# EAGLE design SCHv2 (EAGLE 9.1.3)
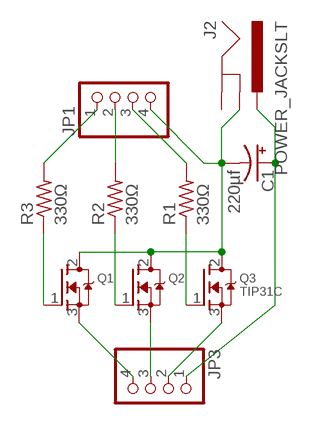
[diagram p0: schematic, sheet 1]

## Parts
C1  220µf  CPOL-USE2.5-7  [E2,5-7]
J2  POWER_JACKSLT  [POWER_JACK_SLOT]
JP1  PINHD-1X4/90  [1X04/90]
JP3  PINHD-1X4/90  [1X04/90]
Q1  MOSFET-NGDS_TO220V  [TO220V]
Q2  MOSFET-NGDS_TO220V  [TO220V]
Q3  TIP31C  MOSFET-NGDS_TO220V  [TO220V]
R1  330Ω  R-US_0207/7  [0207/7]
R2  330Ω  R-US_0207/7  [0207/7]
R3  330Ω  R-US_0207/7  [0207/7]

## Nets
N$1: JP1.1 R3.2
N$2: JP1.2 R2.2
N$3: JP1.3 R1.2
N$4: C1.- J2.GND@1(GNDBREAK) JP1.4 Q1.2(D) Q2.2(D) Q3.2(D)
N$5: C1.+ J2.PWR JP3.1
N$6: Q1.1(G) R3.1
N$7: Q2.1(G) R2.1
N$8: Q3.1(G) R1.1
N$9: JP3.2 Q3.3(S)
N$10: JP3.3 Q2.3(S)
N$11: JP3.4 Q1.3(S)
Unconnected: J2.GND@2(GND)

## Library data of the parts
C1 = rcl:CPOL-US: POLARIZED CAPACITOR, American symbol; SPICEPREFIX: C
J2 = SparkFun-Connectors:POWER_JACK: Power Jack Connector This is the standard 5.5mm barrel jack for power. The PTH is the most common, proven, reliable, footprint. The Slot footprint only works if the mill layer is transmitted to the PCB fab house so be warned. Here are the connectors we sell at SparkFun: DC Barrel Power Jack/Connector <https://www.sparkfun.com/products/119> (PRT-00119) DC Barrel Power Jack/Connector (SMD) <https://www.sparkfun.com/products/12748> (PRT-12748) DC Barrel Jack Adapter - Breadboard Compatible <https://www.sparkfun.com/products/10811> (PRT-10811) It is used on this SparkFun product (and many, many others): SparkFun RedBoard - Programmed with Arduino <https://www.sparkfun.com/products/12757> (DEV-12757) Also, if you need a mating power supply or connector, please check these out: Wall Adapter Power Supply - 9VDC 650mA <https://www.sparkfun.com/products/298> (TOL-00298) DC Barrel Jack Adapter - Male <https://www.sparkfun.com/products/10287> (PRT-10287); PROD_ID: PRT-00119
JP1 JP3 = pinhead:PINHD-1X4: PIN HEADER
Q1-Q3 = adafruit:MOSFET-N: N-Channel Mosfet 2N7002E - 60V 260mA SOT23 [Digikey: 2N7002ET1GOSTR-ND] - REEL BSH103 - 30V 850mA SOT23 [Digikey: 568-5013-1-ND]
R1-R3 = rcl:R-US_: RESISTOR, American symbol; SPICEPREFIX: R

## Board
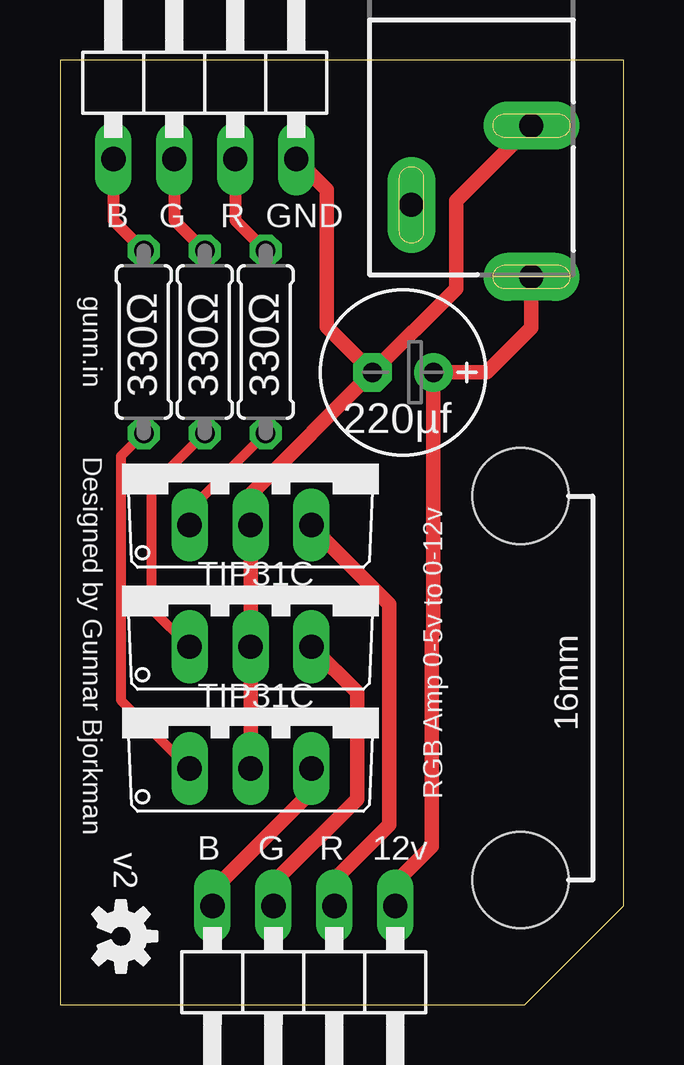
[diagram p1: board, top side]

Size 23.49 x 39.37 mm. Coordinates in mm from the lower left corner, seen from the top.
Outline: 23.49,39.37 0,39.37 0,0 18.1,0 19.37,0 23.49,4.13 23.49,39.37
Copper layers (1*16): Top 0.035mm / dielectric 1.5mm / Bottom 0.035mm
Design rules "default": minimum track width 6mil, minimum drill 0.35mm, track to track 6mil, track to pad 6mil, pad to pad 6mil, via to via 6mil, smd to smd 6mil, copper to edge 40mil, drill to drill 6mil, minimum pad ring 10mil, minimum via ring 8mil, stop-mask expansion 4mil, vias tented up to drill 0mil, thermal gap 10mil
Holes 4 mm at 19.19,21.2 19.19,5.2

### Footprints (pad centres in the part's own frame; a part is rotated, then mirrored left to right if it is on the bottom)
E2,5-7 = drill 0.813 pad 1.6: + -1.27,0 | drill 0.813 pad 1.6 octagon: - 1.27,0
POWER_JACK_SLOT = drill 1 pad 2 long: GND@1 2.58,7.5; GND@2 7.58,10.8; PWR 2.58,13.8
1X04/90 = drill 1.016 long: 1 -3.81,-3.81; 2 -1.27,-3.81; 3 1.27,-3.81; 4 3.81,-3.81
TO220V = drill 1.016 long: 1 -2.54,-2.54; 2 0,-2.54; 3 2.54,-2.54
0207/7 = drill 0.813 octagon: 1 -3.81,0; 2 3.81,0

### Placement (x,y rotation side)
C1  14.29,26.35 180 top
J2  22.23,44.13 180 top
JP1  6.03,39.05 0 top
JP3  10.16,0.32 180 top
Q1  7.94,12.38 0 top
Q2  7.94,17.46 0 top
Q3  7.94,22.54 0 top
R1  8.57,27.62 90 top
R2  6.03,27.62 90 top
R3  3.49,27.62 90 top
U$2  [OSHW-LOGO-S]  2.54,2.86 270 top

### Tracks (layer width: path | path; a pad name or v marks a point on that pad's centre or on a via)
N$1
  Top 0.508: JP1.1 2.22,32.7 R3.2
N$2
  Top 0.508: JP1.2 4.76,32.7 R2.2
N$3
  Top 0.508: JP1.3 7.3,32.7 R1.2
N$4
  Top 0.61: Q1.2 Q2.2 Q3.2 7.94,21.27 C1.- | 11.11,33.34 11.11,33.97 JP1.4 | 11.11,33.34 11.11,33.02 11.11,28.26 C1.- | 11.12,33.33 11.11,33.34 | C1.- 16.51,29.84 16.51,33.5 J2.GND@1
N$5
  Top 0.61: J2.PWR 19.65,28.22 17.78,26.35 C1.+ 15.56,15.52 15.49,15.46 15.49,6.6 13.97,5.08 JP3.1
N$6
  Top 0.406: Q1.1 2.54,12.7 2.54,22.86 R3.1
N$7
  Top 0.406: R2.1 3.81,21.59 3.81,16.51 Q2.1
N$8
  Top 0.406: Q3.1 5.4,20.64 R1.1
N$9
  Top 0.61: Q3.3 10.48,19.95 13.73,16.7 13.73,7.51 11.43,5.21 JP3.2
N$10
  Top 0.61: Q2.3 10.48,14.87 10.53,14.87 12.38,13.02 12.38,8.57 8.89,5.08 JP3.3
N$11
  Top 0.61: JP3.4 6.35,4.76 10.48,8.89 Q1.3

### Text on the board
tPlace: B | G | R | GND | gunn.in | Designed by Gunnar Bjorkman | TIP31C | TIP31C | 16mm | RGB Amp 0-5v to 0-12v | v2 | B | G | R | 12v